# Altium schematic sheet SRIC_Peripherals.SchDoc
size 420 x 297 mm; SheetNumber: 10; SheetTotal: 21
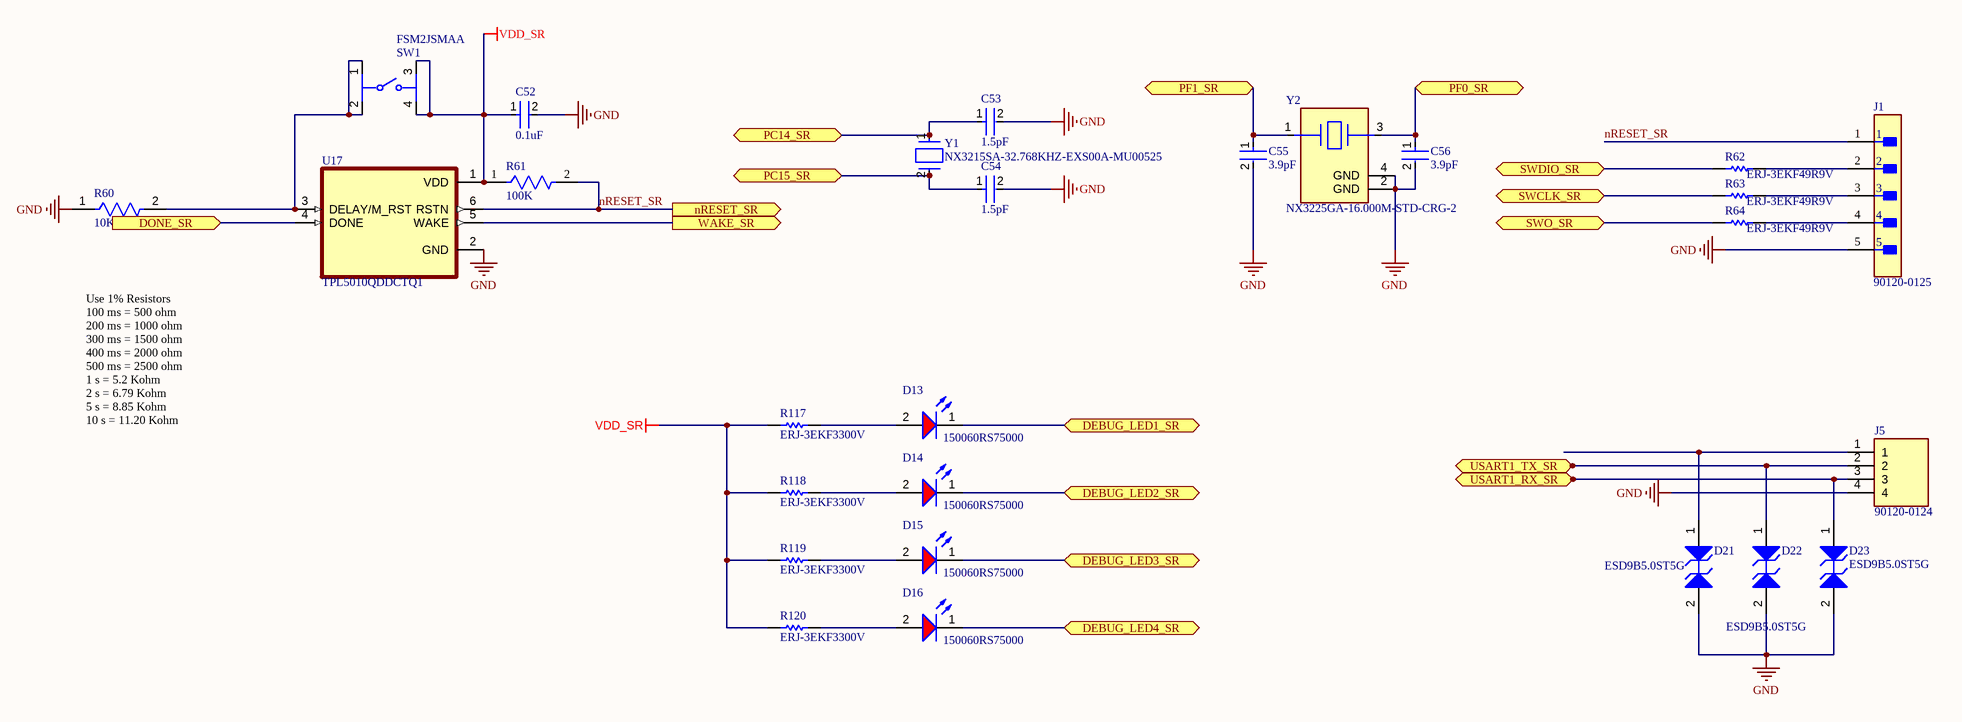
[diagram p0: SRIC_Peripherals.SchDoc]

## Parts
C52  0.1uF  [FP-C0603C-CF-MFG]
C53  1.5pF  [FP-C0603C-CF-MFG]
C54  1.5pF  [FP-C0603C-CF-MFG]
C55  3.9pF  [FP-CBR06C-MFG]
C56  3.9pF  [FP-CBR06C-MFG]
D13  150060RS75000  [WL-SMCW_0603_150060xx75000]
D14  150060RS75000  [WL-SMCW_0603_150060xx75000]
D15  150060RS75000  [WL-SMCW_0603_150060xx75000]
D16  150060RS75000  [WL-SMCW_0603_150060xx75000]
D21  ESD9B5.0ST5G  [ONSC-SOD-923-2-514AB-01_V]
D22  ESD9B5.0ST5G  [ONSC-SOD-923-2-514AB-01_V]
D23  ESD9B5.0ST5G  [ONSC-SOD-923-2-514AB-01_V]
J1  90120-0125  [FP-90120-0125-MFG]
J5  90120-0124  [HDRV4W65P0X254_1X4_1016X254X945P]
R60  10K  [FP-RK73B1J-MFG]
R61  100K  [FP-ERA3A-MFG]
R62  ERJ-3EKF49R9V  [RESC1608X55X30ML15T15]
R63  ERJ-3EKF49R9V  [RESC1608X55X30ML15T15]
R64  ERJ-3EKF49R9V  [RESC1608X55X30ML15T15]
R117  ERJ-3EKF3300V  [RESC1608X55X30LL15T15]
R118  ERJ-3EKF3300V  [RESC1608X55X30LL15T15]
R119  ERJ-3EKF3300V  [RESC1608X55X30LL15T15]
R120  ERJ-3EKF3300V  [RESC1608X55X30LL15T15]
SW1  FSM2JSMAA  [FP-FSM2JSMAA-MFG]
U17  TPL5010QDDCTQ1  [SOT95P280X110-6N]
Y1  NX3215SA-32.768KHZ-EXS00A-MU00525  [FP-NX3215SA-MFG]
Y2  NX3225GA-16.000M-STD-CRG-2  [FP-NX3225GA-MFG]

## Ports
DEBUG_LED1_SR (bidir), DEBUG_LED2_SR (bidir), DEBUG_LED3_SR (bidir), DEBUG_LED4_SR (bidir), DONE_SR (in), nRESET_SR (out), PC14_SR (bidir), PC15_SR (bidir), PF0_SR (bidir), PF1_SR (bidir), SWCLK_SR (bidir), SWDIO_SR (bidir), SWO_SR (bidir), USART1_RX_SR (bidir), USART1_TX_SR (bidir), WAKE_SR (out)

## Nets
GND: C52.2 C53.2 C54.2 C55.2 C56.2 D21.2(A2) D22.2(A2) D23.2(A2) J1.5 J5.4 R60.1 U17.2(GND) Y2.2(GND) Y2.4(GND)
VDD_SR: C52.1 R61.1 R117.1 R118.1 R119.1 R120.1 SW1.3 SW1.4 U17.1(VDD)
DEBUG_LED1_SR: D13.1(K) ; port DEBUG_LED1_SR
DEBUG_LED2_SR: D14.1(K) ; port DEBUG_LED2_SR
DEBUG_LED3_SR: D15.1(K) ; port DEBUG_LED3_SR
DEBUG_LED4_SR: D16.1(K) ; port DEBUG_LED4_SR
DONE_SR: U17.4(DONE) ; port DONE_SR
nRESET_SR: J1.1 R61.2 U17.6(RSTN) ; port nRESET_SR
PC14_SR: C53.1 Y1.1 ; port PC14_SR
PC15_SR: C54.1 Y1.2 ; port PC15_SR
PF0_SR: C56.1 Y2.3 ; port PF0_SR
PF1_SR: C55.1 Y2.1 ; port PF1_SR
SWCLK_SR: R63.1 ; port SWCLK_SR
SWDIO_SR: R62.1 ; port SWDIO_SR
SWO_SR: R64.1 ; port SWO_SR
USART1_RX_SR: D23.1(A1) J5.3 ; port USART1_RX_SR
USART1_TX_SR: D22.1(A1) J5.2 ; port USART1_TX_SR
WAKE_SR: U17.5(WAKE) ; port WAKE_SR
NetD13_2: D13.2(A) R117.2
NetD14_2: D14.2(A) R118.2
NetD15_2: D15.2(A) R119.2
NetD16_2: D16.2(A) R120.2
NetD21_1: D21.1(A1) J5.1
NetJ1_2: J1.2 R62.2
NetJ1_3: J1.3 R63.2
NetJ1_4: J1.4 R64.2
NetR60_2: R60.2 SW1.1 SW1.2 U17.3(DELAY/M_RST)

## Notes on the sheet
- Use 1% Resistors
  100 ms = 500 ohm
  200 ms = 1000 ohm
  300 ms = 1500 ohm
  400 ms = 2000 ohm
  500 ms = 2500 ohm
  1 s = 5.2 Kohm
  2 s = 6.79 Kohm
  5 s = 8.85 Kohm
  10 s = 11.20 Kohm
- THIS DOCUMENT AND THE DATA DISCLOSED HEREIN OR
- HEREWITH IS THE PROPERTY OF ALTIUM LIMITED AND MAY
- DWG NO:
- REVISION
- REV:
- DESCRIPTION
- DATE
- APPROVED
- BE FREELY DISTRIBUTED IN WHOLE. NO RIGHTS ARE
- RESERVED OR EXPRESS OR IMPLIED WARANTEE GIVEN.
- ENG:
- APPROVALS
- PROJECT
- DSN:
- CHK:
- REFERENCE DOCUMENTS
- PROJECT REVISION:
- TITLE
- DOCUMENT REVISION:
- DESIGN ITEM:
- BOM:
- FAB DWG:
- PCB DWG:
- ASSY DWG:
- SCALE:
- A3
- SIZE
- CAGE CODE
- FILE NAME
- DWG NO.
- SHEET
- OF
- REV

## Library data of the parts
C52 = CMP-2006-03061-2: CAP CER 0.1UF 50V X7R 0603; Manufacturer: KEMET; Manufacturer Part Number: C0603C104K5RACTU; Tolerance: 0.1; Temperature Coefficient: 30ppm/°C; Material: Ceramic; Automotive Grade: Grade 1; Value: 0.10 μF; Temperature: -55°C to +125°C; RoHS: TRUE; Temperature Range High: +125°C; Lead Free: Yes; Octopart: https://octopart.com/c0603c104k5ractu-kemet-139244; Digikey Description: CAP CER 0.1UF 50V X7R 0603; Category: Cap; Package: C0603C-CF; ComponentLink2Description: Datasheet; Temperature Range Low: -55°C; Device Class L1: Passive Components; Voltage Rating: 50 V; Automotive: Yes; Device Class L3: Ceramic Capacitors; ComponentLink2URL: https://api.kemet.com/component-edge/download/datasheet/C0603C100J5GACAUTO.pdf; Capacitance: 0.10 μF; Device Class L2: Capacitors; Temperature Characteristic: X7R; Height: 0.87mm
C53 C54 = CMP-2006-03373-2: CAP CER 1.5PF 100V NP0 0603; Manufacturer Part Number: C0603C159C1GACTU; Manufacturer: KEMET; Material: Ceramic; Temperature Coefficient: 30ppm/°C; Temperature Characteristic: C0G; Tolerance: 0.25 pF; Automotive Grade: Grade 1; Mouser Description: Multilayer Ceramic Capacitors MLCC - SMD/SMT 100volts 1.5pF C0G 0.25%; Lead Free: Yes; Value: 1.5 pF; Temperature Range Low: -55°C; Temperature: -55°C to +125°C; Device Class L1: Passive Components; Device Class L3: Ceramic Capacitors; Package: C0603C-CF; Category: Cap; ComponentLink2Description: Datasheet; Voltage Rating: 100 V; Device Class L2: Capacitors; Height: 0.87mm; Temperature Range High: +125°C; RoHS: TRUE; Octopart: https://octopart.com/c0603c159c1gactu-kemet-9144220; Digikey Description: CAP CER 1.5PF 100V NP0 0603; Automotive: Yes; ComponentLink2URL: https://api.kemet.com/component-edge/download/datasheet/C0603C100J5GACAUTO.pdf; Capacitance: 1.5 pF
C55 C56 = CMP-2006-02987-2: CAP CER 3.9PF 250V C0G/NP0 0603; Manufacturer Part Number: CBR06C399CAGAC; Manufacturer: KEMET; Material: Ceramic; Tolerance: 0.25 pF; Temperature Characteristic: C0G; Temperature Coefficient: 30ppm/°C; Octopart: https://octopart.com/cbr06c399cagac-kemet-20446767; Height: 0.87mm; Category: Cap; Temperature: -55°C to +125°C; Device Class L1: Passive Components; Capacitance: 3.9 pF; Device Class L3: Ceramic Capacitors; Value: 3.9 pF; Voltage Rating: 250 V; Mouser Description: Multilayer Ceramic Capacitors MLCC - SMD/SMT 250volts 3.9pF C0G 0603 .25pF Tol RF; Temperature Range High: +125°C; Ipc Land Pattern Name: CAPC16080X80; ComponentLink2Description: Datasheet; Temperature Range Low: -55°C; Digikey Description: CAP CER 3.9PF 250V C0G/NP0 0603; ComponentLink2URL: https://content.kemet.com/datasheets/KEM_C1030_CBR_SMD.pdf; Lead Free: Yes; Package: CBR06C; Device Class L2: Capacitors; RoHS: TRUE; Automotive: No
D13-D16 = CMP-1426-00001-4: LED Low-Power Uni-Color Red 630nm 2V 2-Pin Chip 0603(1608Metric) T/R; Max Junction Temperature (Tj): 95°C; Dominant Wavelength: 625nm; Lens Style: Clear, Rectangular; Viewing Angle: 140°; Forward Current: 100mA; Max Reverse Voltage (DC): 5V; Luminous Intensity: 250mcd; Test Current: 20mA; Power Dissipation: 72mW; Max Operating Temperature: 85°C; Mount: Surface Mount; Height: 700µm; Packaging: Tape and Reel; REACH SVHC: Unknown; Case Code (Metric): 1608; Peak Wavelength: 630nm; Forward Voltage: 2V; Case/Package: 0603; Color: Red; RoHS: Compliant; Width: 800µm; Reverse Voltage: 5V; Min Operating Temperature: -40°C; Wavelength: 625nm; Case Code (Imperial): 0603; Length: 1.6mm
D21-D23 = CMP-1063-00119-1: Transient Voltage Suppressor, Micro-Packaged Diode for ESD Protection, 2-Pin SOD-923, Pb-Free, Tape and Reel; Manufacturer: On Semiconductor; Number of Lines: 1; Direction: Bidirectional; V(BR) Min (V): 5.8; VRWM Max (V): 5; Packing: Tape and Reel; PackageDescription: 2-Pin SOD, Body 0.8 x 0.6 mm; IR Max (uA): 1; ComponentLink3Description: Package Specification; PartNumber: ESD9B5.0ST5G; ComponentLink1URL: http://www.onsemi.com/; RoHS: Pb-Free; Mounting Technology: Surface Mount; DatasheetVersion: Rev. 2; ComponentLink2URL: http://www.onsemi.cn/pub_link/Collateral/ESD9B-D.PDF; ComponentLink3URL: http://www.onsemi.com/pub_link/Collateral/514AB.PDF; PackageReference: SOD-923-2-514AB-01; PackageVersion: Rev. C, 03/2011; ComponentLink1Description: Manufacturer URL; ComponentLink2Description: Datasheet
J1 = CMP-00257-00655425-1: 90120-0125 2.54mm Pitch C-Grid III Header, Single Row, Vertical, 5 Circuits, Tin (Sn) Plating; NexarPartId: 655425; Manufacturer Lifecycle Status: ACTIVE; Lead Length: 2.9mm; Number of Positions: 5; Current Rating: 3A; Mating Post Length: 6.75mm; Glow Wire Compliant: Non-compliant; Contact Resistance: 20mΩ; Voltage Rating: 350V; Gender: Male; Max Voltage Rating (DC): 350.35kV; Max Operating Temperature: 125°C; Number of Pins: 5; Plating: Tin; Contact Material: Brass; Mount: Through Hole; Contact Gender: Male; Packaging: Bulk; Schedule B: 8536694040; Lifecycle Status: Production; Lead Pitch: 2.54mm; Radiation Hardening: No; Orientation: Vertical; Min Operating Temperature: -55°C; Country of Origin: SK; Housing Color: Black; REACH SVHC: No SVHC; Contact Plating: Tin; Number of Rows: 1; Number of Circuits: 5; Termination: Solder; Number of Contacts: 5; Pitch: 2.54mm; Housing Material: Polyester; RoHS: Compliant; Lead Free: Lead Free; Voltage Rating (AC): 350V
J5 = 90120-0124: Connector; Manufacturer_Name: Molex; Datasheet Link: https://componentsearchengine.com/Datasheets/2/90120-0124.pdf; Height: 9.45mm; Manufacturer_Part_Number: 90120-0124; Mouser Part Number: 538-90120-0124; Mouser Price/Stock: https://www.mouser.co.uk/ProductDetail/Molex/90120-0124?qs=PvP5v7EimsmprSEogp1JLQ%3D%3D
R60 = CMP-2000-01851-2: RES 10K OHM 5% 1/10W 0603; Temperature Coefficient: 200ppm/°C; Voltage Rating: 50V; Power Rating: 100mW; Resistance: 10kR; Length: 1.6mm; Lead Free: Lead Free; Resistance Tolerance: 5%; Case Code (Metric): 1608; Width: 0.8mm; Height: 0.45mm; Max Operating Temperature: 155°C; RoHS Compliant: Yes; Resistor Type: Thick Film; Min Operating Temperature: -55°C; Case Code (Imperial): 0603; Technology: THICK FILM; Package Quantity: 5000; Tolerance: 5%; Case/Package: 0603; Voltage Rating (DC): 50V; Depth: 0.8mm; Packaging: Tape and Reel; Number of Pins: 2; Construction: Rectangular; Series: RK73B; Military Standard: Not; Termination: SMD/SMT
R61 = CMP-2000-00875-2: NexarPartId: 1243428; Power Rating: 100mW; Voltage Rating (DC): 75V; Tolerance: 0.1%; Temperature Coefficient: 25ppm/°C; Resistance: 100kΩ; Contact Plating: Tin; Max Operating Temperature: 155°C; Case Code (Imperial): 0603; Packaging: Cut Tape; Width: 800µm; Lead Free: Lead Free; REACH SVHC: No SVHC; Termination: SMD/SMT; Radiation Hardening: No; Length: 1.6mm; Military Standard: Not; Features: Automotive AEC-Q200; Case/Package: 0603; Number of Terminations: 2; Composition: Thin Film; Schedule B: 8533210045, 8533210045; Voltage Rating: 75V; Mount: Surface Mount; Case Code (Metric): 1608; Lifecycle Status: Production; Height: 450µm; RoHS: Compliant; Number of Pins: 2; Max Power Dissipation: 100mW; Min Operating Temperature: -55°C; Depth: 800µm; Working Voltage: 75V
R62-R64 = CMP-2000-00538-1: Manufacturer: Panasonic; Part Number: ERJ-3EKF49R9V
R117-R120 = CMP-2000-00435-2: Chip Resistor, 330 Ohm, +/- 1%, 0.1 W, -55 to 155 degC, 0603 (1608 Metric), RoHS, Tape and Reel; Gender: Male; Mating Cycles: 10000; Current Rating: 500 mA; Voltage Rating: 10 V; REACH SVHC: No SVHC; PackageDescription: 2-Pin Surface Mount Device, Body 1.6 x 0.85 mm; Contact Finish: Gold; Pins: 8; ComponentLink1Description: Manufacturer URL; Packaging: Tape and Reel; Max Operating Temperature: 85 degC; Contact Material: Copper; Height: 1.45 mm; Width: 1.45 mm; DatasheetVersion: Apr-15; Package Quantity: 1500; Contact Plating: Gold; PackageReference: 0603; Mount: Surface Mount; Lead Pitch: 1.1 mm; Min Operating Temperature: -25 degC; ComponentLink1URL: http://www.panasonic.com/; ComponentLink2URL: http://industrial.panasonic.com/cdbs/www-data/pdf/RDA0000/AOA0000C86.pdf; Length: 13.7 mm; ComponentLink2Description: Datasheet; RoHSCompliant: true
SW1 = CMP-03402-000003-1: SWITCH TACTILE SPST-NO 0.05A 24V; Manufacturer: TE Connectivity; Standoff Height: 0.05mm; Contact Current Rating: 50mA; Electromechanical Life: 100000Cycles; Operating Force: 260gf; Contact Resistance: 100mΩ; Package: 0; Temperature Range High: +85°C; Temperature: -35°C to +85°C; Category: Switch; Manufacturer Part Number: FSM2JSMAA; RoHS: TRUE; Mouser Description: Tactile Switches TACTILE 260G FORCE S; Device Class L1: Electromechanical; Mount: Surface Mount; Height: 4.59mm; ComponentLink2URL: https://www.te.com/commerce/DocumentDelivery/DDEController?Action=showdoc&DocId=Customer+Drawing%7F2-1437565-7%7FV%7Fpdf%7FEnglish%7FENG_CD_2-1437565-7_V.pdf%7F2-1437565-8; Temperature Range Low: -35°C; Voltage Rating Dc: 24V; Lead Free: Yes; Automotive: No; Throw Configuration: SPST-NO; Octopart: https://octopart.com/fsm2jsmaa-te+connectivity-41720620; Device Class L2: Switches; Device Class L3: Pushbutton Switches; ComponentLink2Description: Datasheet; Digikey Description: SWITCH TACTILE SPST-NO 0.05A 24V
U17 = CMP-049-000000-1: Automotive AEC-Q100, nano-powered system timer with watchdog function; MF: Texas Instruments; MP: TPL5010QDDCTQ1; Check_prices: https://www.snapeda.com/parts/TPL5010QDDCTQ1/Texas+Instruments/view-part/?ref=eda; Source: TPL5010QDDCTQ1.SchLib; Package: SOT-23-THN-6 Texas Instruments; SnapEDA_Link: https://www.snapeda.com/parts/TPL5010QDDCTQ1/Texas+Instruments/view-part/?ref=snap; Component Type: Standard; Value: *; Pin Count: 6; Design Item ID: TPL5010QDDCTQ1
Y1 = CMP-200220-000018-1: CRYSTAL 32.7680KHZ 6PF SMD; ESR (Equivalent Series Resistance): 70kR; Load Capacitance: 6pF; Frequency: 32.768kHz; Case/Package: SMD/SMT; Packaging: Tape and Reel; Ratings: AEC-Q200; Max Operating Temperature: 85°C; Mount: Surface Mount; Min Operating Temperature: -40°C
Y2 = CMP-200220-000007-1: CRYSTAL 16.0000MHZ 8PF SMD; Frequency Stability: 30ppm; Frequency Tolerance: 20ppm; Frequency: 16MHz; ESR (Equivalent Series Resistance): 80R; Min Operating Temperature: -40°C; Mount: Surface Mount; Width: 0.098inch; Case/Package: SMD/SMT; Max Operating Temperature: 85°C; Number of Pins: 4; Length: 0.126inch; Load Capacitance: 8pF; Packaging: Tape and Reel; Package Quantity: 3000; Height: 0.035inch